# Altium schematic sheet Potard.SchDoc
size A4
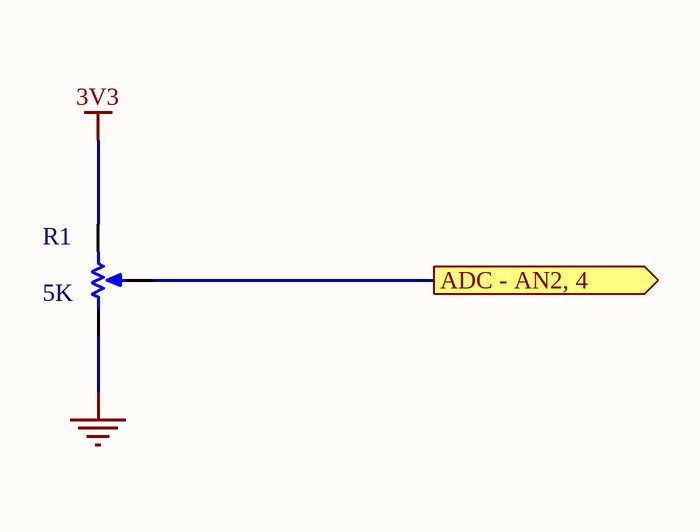
[diagram p0: Potard.SchDoc]

## Parts
R1  5K  [VR5]

## Ports
ADC - AN2, 4 (out)

## Nets
3V3: R1.2(BOT)
ADC - AN2, 4: R1.3(TAP) ; port ADC - AN2, 4

Not connected (* = marked no-connect by the designer): R1 1(TOP)

## Library data of the parts
R1 = RPot: Potentiometer; Sim Note: Enter the Resistance value and the set point into parameter fields.; Set Position: 0.5; Fournisseur: Farnell; Fabricant: BOURNS; RefFabricant: 91A1A-B28-B13L; RefFournisseur: 9357750; Published: 8-Jun-2000; LatestRevisionDate: 17-Jul-2002; LatestRevisionNote: Re-released for DXP Platform.; PackageReference: VR5; Publisher: Altium Limited; PackageDescription: Variable Resistor, Thru-Hole; 3 Leads; Value: 5K